# Altium schematic sheet Top.SchDoc
size A4; SheetNumber: 1; SheetTotal: 6
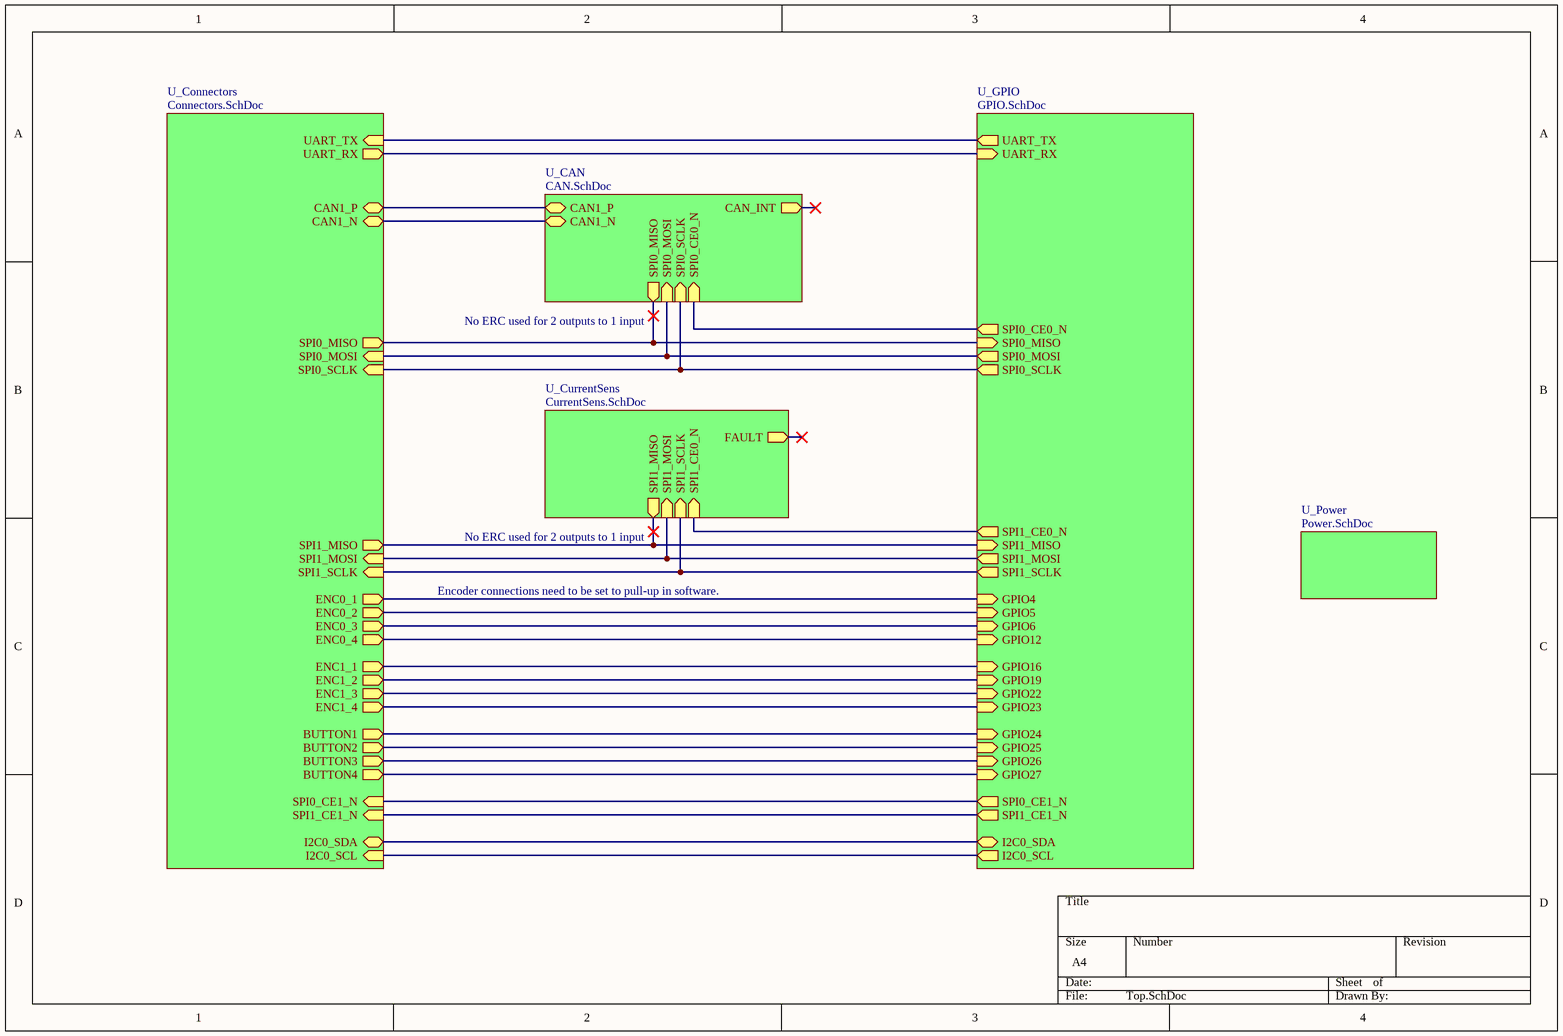
[diagram p0: Top.SchDoc]

## Sub-sheets
U_CAN = CAN.SchDoc: CAN1_P (bidir), CAN1_N (bidir), CAN_INT (out), SPI0_CE0_N (in), SPI0_SCLK (in), SPI0_MOSI (in), SPI0_MISO (out)
U_Connectors = Connectors.SchDoc: ENC0_1 (out), ENC0_2 (out), ENC0_4 (out), ENC0_3 (out), ENC1_1 (out), ENC1_3 (out), ENC1_2 (out), ENC1_4 (out), BUTTON1 (out), BUTTON3 (out), BUTTON4 (out), BUTTON2 (out), I2C0_SDA (bidir), I2C0_SCL (in), CAN1_P (bidir), CAN1_N (bidir), UART_TX (in), UART_RX (out), SPI0_MOSI (in), SPI0_MISO (out), SPI0_CE1_N (in), SPI0_SCLK (in), SPI1_SCLK (in), SPI1_CE1_N (in), SPI1_MISO (out), SPI1_MOSI (in)
U_CurrentSens = CurrentSens.SchDoc: SPI1_MISO (out), SPI1_CE0_N (in), SPI1_SCLK (in), SPI1_MOSI (in), FAULT (out)
U_GPIO = GPIO.SchDoc: I2C0_SDA (bidir), I2C0_SCL (out), GPIO4 (in), SPI1_CE1_N (out), GPIO27 (in), GPIO22 (in), SPI0_MOSI (out), SPI0_MISO (in), SPI0_SCLK (out), GPIO26 (in), GPIO19 (in), GPIO6 (in), GPIO5 (in), SPI1_MISO (in), SPI1_MOSI (out), SPI0_CE1_N (out), SPI1_SCLK (out), SPI0_CE0_N (out), UART_RX (in), UART_TX (out), GPIO23 (in), GPIO24 (in), GPIO25 (in), GPIO12 (in), GPIO16 (in), SPI1_CE0_N (out)
U_Power = Power.SchDoc: no entries

## Nets
(unnamed): sheet U_GPIO/I2C0_SDA, sheet U_Connectors/I2C0_SDA
(unnamed): sheet U_GPIO/I2C0_SCL, sheet U_Connectors/I2C0_SCL
(unnamed): sheet U_GPIO/GPIO4, sheet U_Connectors/ENC0_1
(unnamed): sheet U_GPIO/SPI1_CE1_N, sheet U_Connectors/SPI1_CE1_N
(unnamed): sheet U_GPIO/GPIO27, sheet U_Connectors/BUTTON4
(unnamed): sheet U_GPIO/GPIO22, sheet U_Connectors/ENC1_3
(unnamed): sheet U_GPIO/SPI0_MOSI, sheet U_CAN/SPI0_MOSI, sheet U_Connectors/SPI0_MOSI
(unnamed): sheet U_GPIO/SPI0_MISO, sheet U_CAN/SPI0_MISO, sheet U_Connectors/SPI0_MISO
(unnamed): sheet U_GPIO/SPI0_SCLK, sheet U_CAN/SPI0_SCLK, sheet U_Connectors/SPI0_SCLK
(unnamed): sheet U_GPIO/GPIO26, sheet U_Connectors/BUTTON3
(unnamed): sheet U_GPIO/GPIO19, sheet U_Connectors/ENC1_2
(unnamed): sheet U_GPIO/GPIO6, sheet U_Connectors/ENC0_3
(unnamed): sheet U_GPIO/GPIO5, sheet U_Connectors/ENC0_2
(unnamed): sheet U_GPIO/SPI1_MISO, sheet U_CurrentSens/SPI1_MISO, sheet U_Connectors/SPI1_MISO
(unnamed): sheet U_GPIO/SPI1_MOSI, sheet U_CurrentSens/SPI1_MOSI, sheet U_Connectors/SPI1_MOSI
(unnamed): sheet U_GPIO/SPI0_CE1_N, sheet U_Connectors/SPI0_CE1_N
(unnamed): sheet U_GPIO/SPI1_SCLK, sheet U_CurrentSens/SPI1_SCLK, sheet U_Connectors/SPI1_SCLK
(unnamed): sheet U_GPIO/SPI0_CE0_N, sheet U_CAN/SPI0_CE0_N
(unnamed): sheet U_GPIO/UART_RX, sheet U_Connectors/UART_RX
(unnamed): sheet U_GPIO/UART_TX, sheet U_Connectors/UART_TX
(unnamed): sheet U_GPIO/GPIO23, sheet U_Connectors/ENC1_4
(unnamed): sheet U_GPIO/GPIO24, sheet U_Connectors/BUTTON1
(unnamed): sheet U_GPIO/GPIO25, sheet U_Connectors/BUTTON2
(unnamed): sheet U_GPIO/GPIO12, sheet U_Connectors/ENC0_4
(unnamed): sheet U_GPIO/GPIO16, sheet U_Connectors/ENC1_1
(unnamed): sheet U_GPIO/SPI1_CE0_N, sheet U_CurrentSens/SPI1_CE0_N
(unnamed): sheet U_CAN/CAN1_P, sheet U_Connectors/CAN1_P
(unnamed): sheet U_CAN/CAN1_N, sheet U_Connectors/CAN1_N

## Notes on the sheet
- No ERC used for 2 outputs to 1 input
- Encoder connections need to be set to pull-up in software.